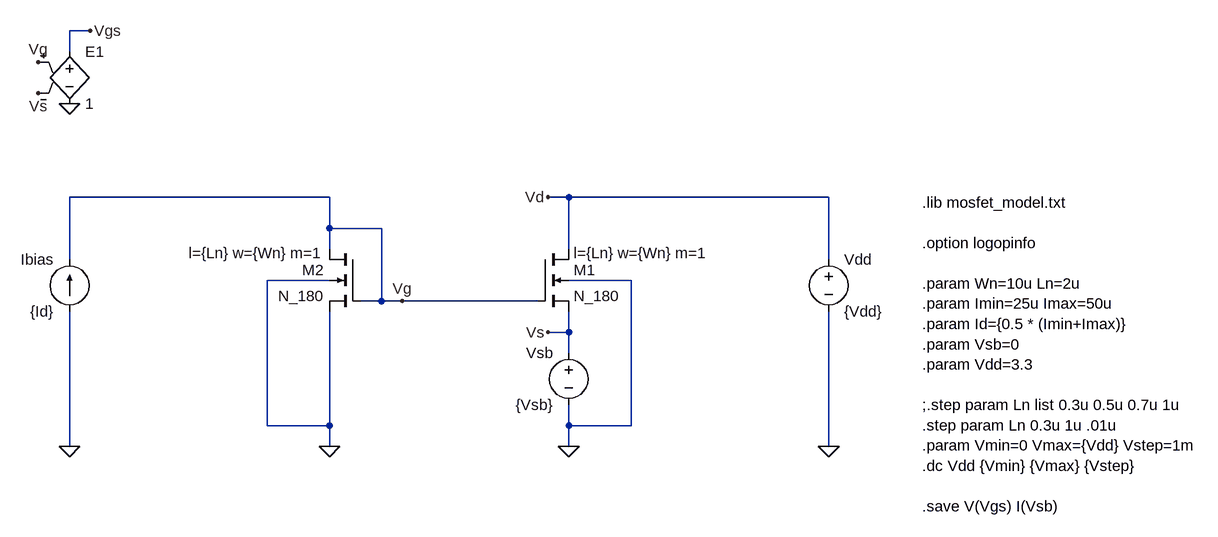
[diagram p0: schematic nmos_mirror.asc]
nmos_mirror.asc, the LTspice schematic file:
Version 4.1
SHEET 1 1772 680
WIRE -16 -272 -48 -272
WIRE -48 -240 -48 -272
WIRE 352 -16 -48 -16
WIRE 720 -16 688 -16
WIRE 1120 -16 720 -16
WIRE 352 32 352 -16
WIRE 432 32 352 32
WIRE 352 64 352 32
WIRE 720 64 720 -16
WIRE -48 80 -48 -16
WIRE 1120 80 1120 -16
WIRE 352 112 256 112
WIRE 816 112 720 112
WIRE 432 144 432 32
WIRE 432 144 400 144
WIRE 464 144 432 144
WIRE 672 144 464 144
WIRE 720 192 720 160
WIRE 720 192 688 192
WIRE 720 224 720 192
WIRE 256 336 256 112
WIRE 352 336 352 160
WIRE 352 336 256 336
WIRE 720 336 720 304
WIRE 816 336 816 112
WIRE 816 336 720 336
WIRE -48 368 -48 160
WIRE 352 368 352 336
WIRE 720 368 720 336
WIRE 1120 368 1120 160
FLAG -48 368 0
FLAG 352 368 0
FLAG 464 144 Vg
FLAG 720 368 0
FLAG 688 192 Vs
FLAG 1120 368 0
FLAG 688 -16 Vd
FLAG -48 -160 0
FLAG -16 -272 Vgs
FLAG -96 -224 Vg
FLAG -96 -176 Vs
SYMBOL current -48 160 R180
WINDOW 0 24 80 Left 2
WINDOW 3 24 0 Left 2
SYMATTR InstName Ibias
SYMATTR Value {Id}
SYMBOL nmos4 400 64 M0
WINDOW 123 56 6 Left 2
SYMATTR Value2 l={Ln} w={Wn} m=1
SYMATTR InstName M2
SYMATTR Value N_180
SYMBOL nmos4 672 64 R0
WINDOW 123 56 6 Left 2
SYMATTR Value2 l={Ln} w={Wn} m=1
SYMATTR InstName M1
SYMATTR Value N_180
SYMBOL voltage 720 208 M0
SYMATTR InstName Vsb
SYMATTR Value {Vsb}
SYMBOL voltage 1120 64 R0
SYMATTR InstName Vdd
SYMATTR Value {Vdd}
SYMBOL e -48 -256 R0
SYMATTR InstName E1
SYMATTR Value 1
TEXT 1264 -8 Left 2 !.lib mosfet_model.txt\n \n.option logopinfo\n \n.param Wn=10u Ln=2u \n.param Imin=25u Imax=50u\n.param Id={0.5 * (Imin+Imax)}\n.param Vsb=0\n.param Vdd=3.3\n \n;.step param Ln list 0.3u 0.5u 0.7u 1u\n.step param Ln 0.3u 1u .01u \n.param Vmin=0 Vmax={Vdd} Vstep=1m\n.dc Vdd {Vmin} {Vmax} {Vstep}\n \n.save V(Vgs) I(Vsb)

The netlist it stands for:
* nmos_mirror.asc
Ibias 0 Vg {Id}
M2 Vg Vg 0 0 N_180 l={Ln} w={Wn} m=1
M1 Vd Vg Vs 0 N_180 l={Ln} w={Wn} m=1
Vsb Vs 0 {Vsb}
Vdd Vd 0 {Vdd}
E1 Vgs 0 Vg Vs 1
.model NMOS NMOS
.model PMOS PMOS
.lib standard.mos
.lib mosfet_model.txt
.option logopinfo
.param Wn=10u Ln=2u
.param Imin=25u Imax=50u
.param Id={0.5 * (Imin+Imax)}
.param Vsb=0
.param Vdd=3.3
;.step param Ln list 0.3u 0.5u 0.7u 1u
.step param Ln 0.3u 1u .01u
.param Vmin=0 Vmax={Vdd} Vstep=1m
.dc Vdd {Vmin} {Vmax} {Vstep}
.save V(Vgs) I(Vsb)
.backanno
.end